# EAGLE design carrier v1.1 (EAGLE 9.1.1)
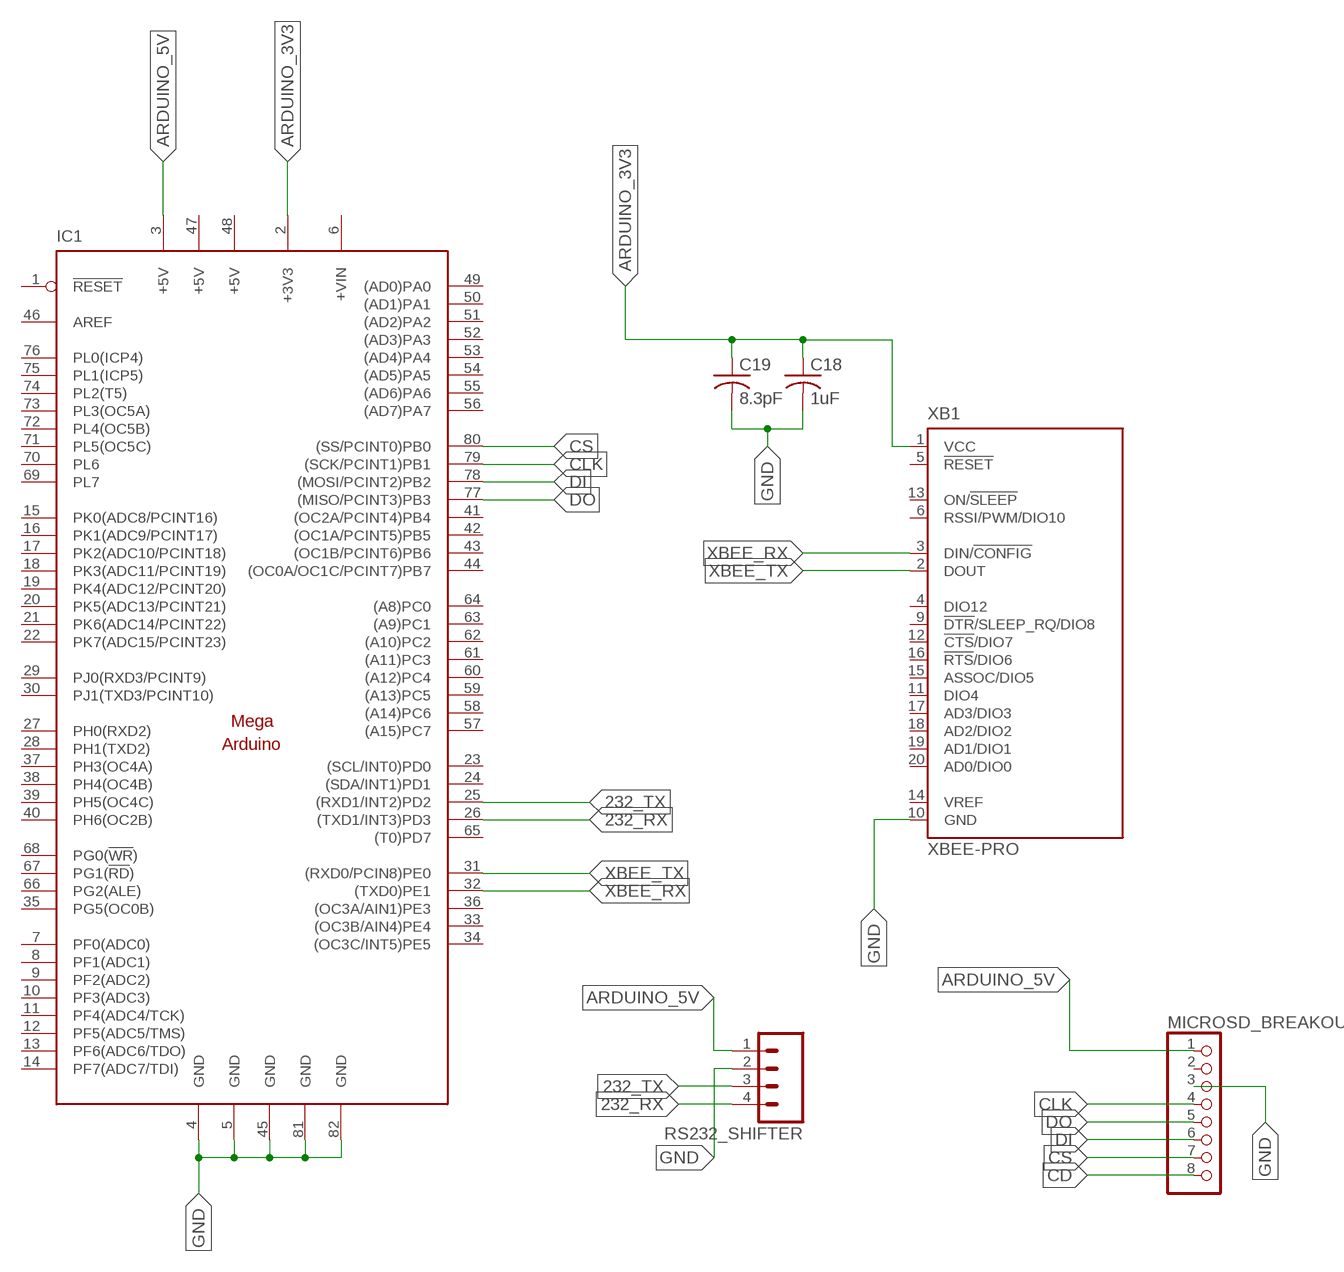
[diagram p0: schematic, sheet 1]

## Parts
C18  1uF  C-USC0805  [C0805]
C19  8.3pF  C-USC0805  [C0805]
IC1  MEGAARDUINO_1  [MEGA_ARDUINO]
MICROSD_BREAKOUT  PINHD-1X8BIG  [1X08-BIG]
RS232_SHIFTER  M04PTH  [1X04]
XB1  XBEE-PRO  [XBEE-PRO]

## Nets
232_RX: IC1.26((TXD1/INT3)PD3) RS232_SHIFTER.4
232_TX: IC1.25((RXD1/INT2)PD2) RS232_SHIFTER.3
ARDUINO_3V3: C18.1 C19.1 IC1.2(+3V3) XB1.1(VCC)
ARDUINO_5V: IC1.3(+5V) MICROSD_BREAKOUT.1 RS232_SHIFTER.1
CD: MICROSD_BREAKOUT.8
CLK: IC1.79((SCK/PCINT1)PB1) MICROSD_BREAKOUT.4
CS: IC1.80((SS/PCINT0)PB0) MICROSD_BREAKOUT.7
DI: IC1.78((MOSI/PCINT2)PB2) MICROSD_BREAKOUT.6
DO: IC1.77((MISO/PCINT3)PB3) MICROSD_BREAKOUT.5
GND: C18.2 C19.2 IC1.4(GND) IC1.5(GND) IC1.45(GND) IC1.81(GND) IC1.82(GND) MICROSD_BREAKOUT.3 RS232_SHIFTER.2 XB1.10(GND)
XBEE_RX: IC1.32((TXD0)PE1) XB1.3(DIN/!CONFIG)
XBEE_TX: IC1.31((RXD0/PCIN8)PE0) XB1.2(DOUT)
Unconnected: IC1.1(!RESET) IC1.7(PF0(ADC0)) IC1.8(PF1(ADC1)) IC1.9(PF2(ADC2)) IC1.10(PF3(ADC3)) IC1.11(PF4(ADC4/TCK)) IC1.12(PF5(ADC5/TMS)) IC1.13(PF6(ADC6/TDO)) IC1.14(PF7(ADC7/TDI)) IC1.15(PK0(ADC8/PCINT16)) IC1.16(PK1(ADC9/PCINT17)) IC1.17(PK2(ADC10/PCINT18)) IC1.18(PK3(ADC11/PCINT19)) IC1.19(PK4(ADC12/PCINT20)) IC1.20(PK5(ADC13/PCINT21)) IC1.21(PK6(ADC14/PCINT22)) IC1.22(PK7(ADC15/PCINT23)) IC1.23((SCL/INT0)PD0) IC1.24((SDA/INT1)PD1) IC1.27(PH0(RXD2)) IC1.28(PH1(TXD2)) IC1.29(PJ0(RXD3/PCINT9)) IC1.30(PJ1(TXD3/PCINT10)) IC1.33((OC3B/AIN4)PE4) IC1.34((OC3C/INT5)PE5) IC1.35(PG5(OC0B)) IC1.36((OC3A/AIN1)PE3) IC1.37(PH3(OC4A)) IC1.38(PH4(OC4B)) IC1.39(PH5(OC4C)) IC1.40(PH6(OC2B)) IC1.41((OC2A/PCINT4)PB4) IC1.42((OC1A/PCINT5)PB5) IC1.43((OC1B/PCINT6)PB6) IC1.44((OC0A/OC1C/PCINT7)PB7) IC1.46(AREF) IC1.49((AD0)PA0) IC1.50((AD1)PA1) IC1.51((AD2)PA2) IC1.52((AD3)PA3) IC1.53((AD4)PA4) IC1.54((AD5)PA5) IC1.55((AD6)PA6) IC1.56((AD7)PA7) IC1.57((A15)PC7) IC1.58((A14)PC6) IC1.59((A13)PC5) IC1.60((A12)PC4) IC1.61((A11)PC3) IC1.62((A10)PC2) IC1.63((A9)PC1) IC1.64((A8)PC0) IC1.65((T0)PD7) IC1.66(PG2(ALE)) IC1.67(PG1(!RD!)) IC1.68(PG0(!WR!)) IC1.69(PL7) IC1.70(PL6) IC1.71(PL5(OC5C)) IC1.72(PL4(OC5B)) IC1.73(PL3(OC5A)) IC1.74(PL2(T5)) IC1.75(PL1(ICP5)) IC1.76(PL0(ICP4)) MICROSD_BREAKOUT.2 XB1.4(DIO12) XB1.5(!RESET) XB1.6(RSSI/PWM/DIO10) XB1.9(!DTR!/SLEEP_RQ/DIO8) XB1.11(DIO4) XB1.12(!CTS!/DIO7) XB1.13(ON/!SLEEP) XB1.14(VREF) XB1.15(ASSOC/DIO5) XB1.16(!RTS!/DIO6) XB1.17(AD3/DIO3) XB1.18(AD2/DIO2) XB1.19(AD1/DIO1) XB1.20(AD0/DIO0)

## Power pins joined to a net without a drawn wire
+5V: IC1.47(+5V) IC1.48(+5V)
+VIN: IC1.6(+VIN)

## Library data of the parts
C18 C19 = resistor:C-US: CAPACITOR, American symbol
IC1 = arduino:MEGAARDUINO_1: The Arduino Mega is a microcontroller board based on the ATmega1280. - 54 digital input/output pins (of which 14 can be used as PWM outputs) - 16 analog inputs - 4 UARTs (hardware serial ports) - 16 MHz crystal oscillator - USB connection - power jack - ICSP header - reset button It contains everything needed to support the microcontroller; simply connect it to a computer with a USB cable or power it with a AC-to-DC adapter or battery to get started. The Mega is compatible with most shields designed for the Arduino Duemilanove or Diecimila. http://arduino.cc/en/Main/ArduinoBoardMega
MICROSD_BREAKOUT = adafruit:PINHD-1X8: PIN HEADER
RS232_SHIFTER = SparkFun-Connectors:M04: Header 4 Standard 4-pin 0.1" header. Use with straight break away headers (SKU : PRT-00116), right angle break away headers (PRT-00553), swiss pins (PRT-00743), machine pins (PRT-00117), and female headers (PRT-00115). Molex polarized connector foot print use with SKU : PRT-08231 with associated crimp pins and housings. 1MM SMD Version SKU: PRT-10208
XB1 = xbee:XBEE: XBee (TM) /XBee-PRO(TM) OEM RF Modules Source: MaxStream, Inc. xbee_productmanual.pdf; MPN: XBP24-AWI-001; OC_FARNELL: 1337916; OC_NEWARK: 42M2667

## Board
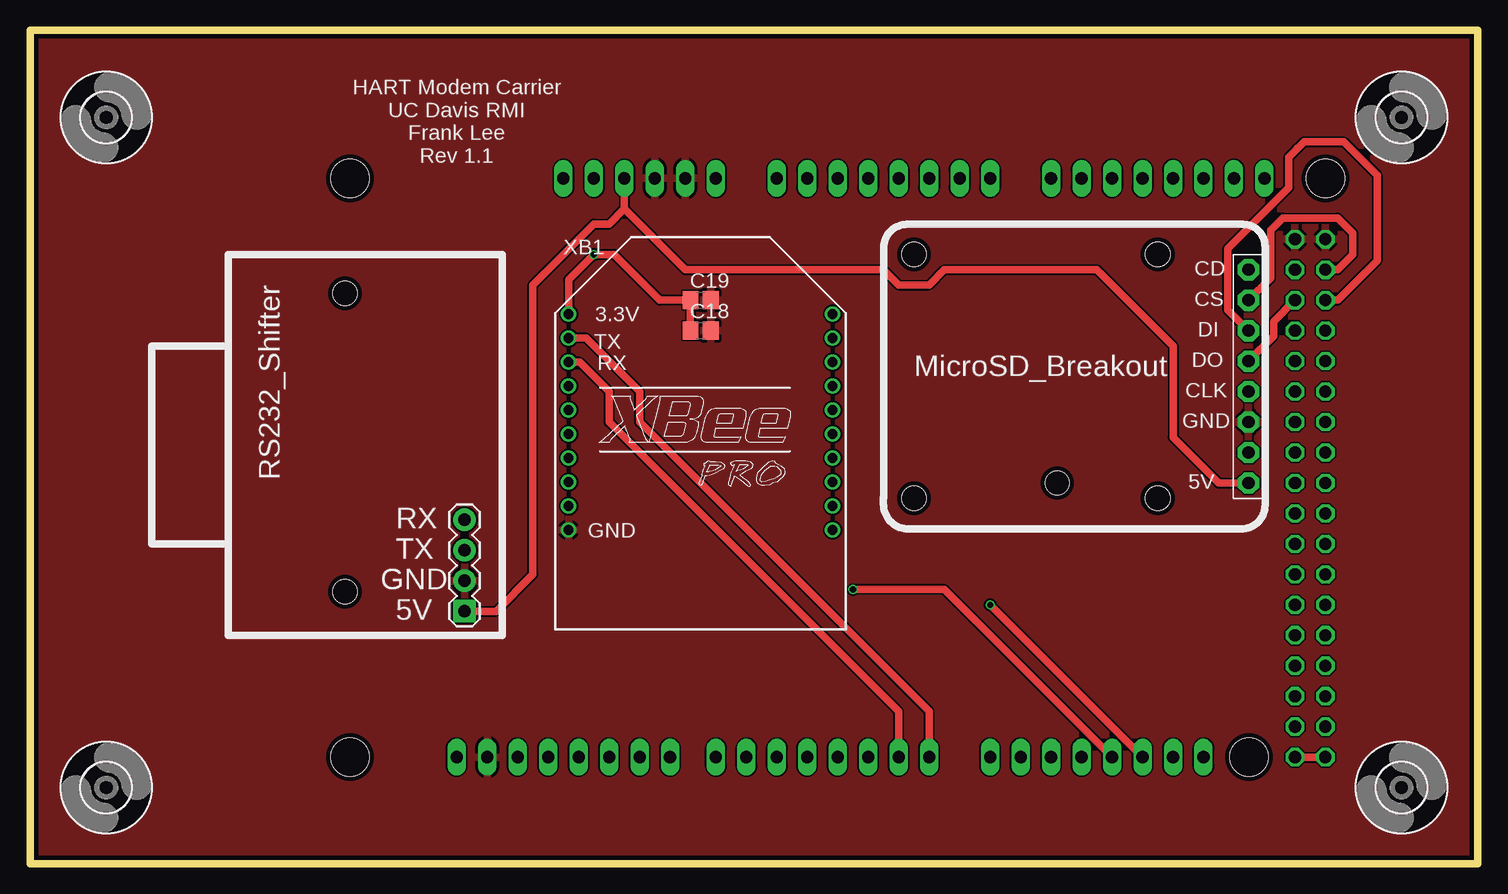
[diagram p1: board, top side]
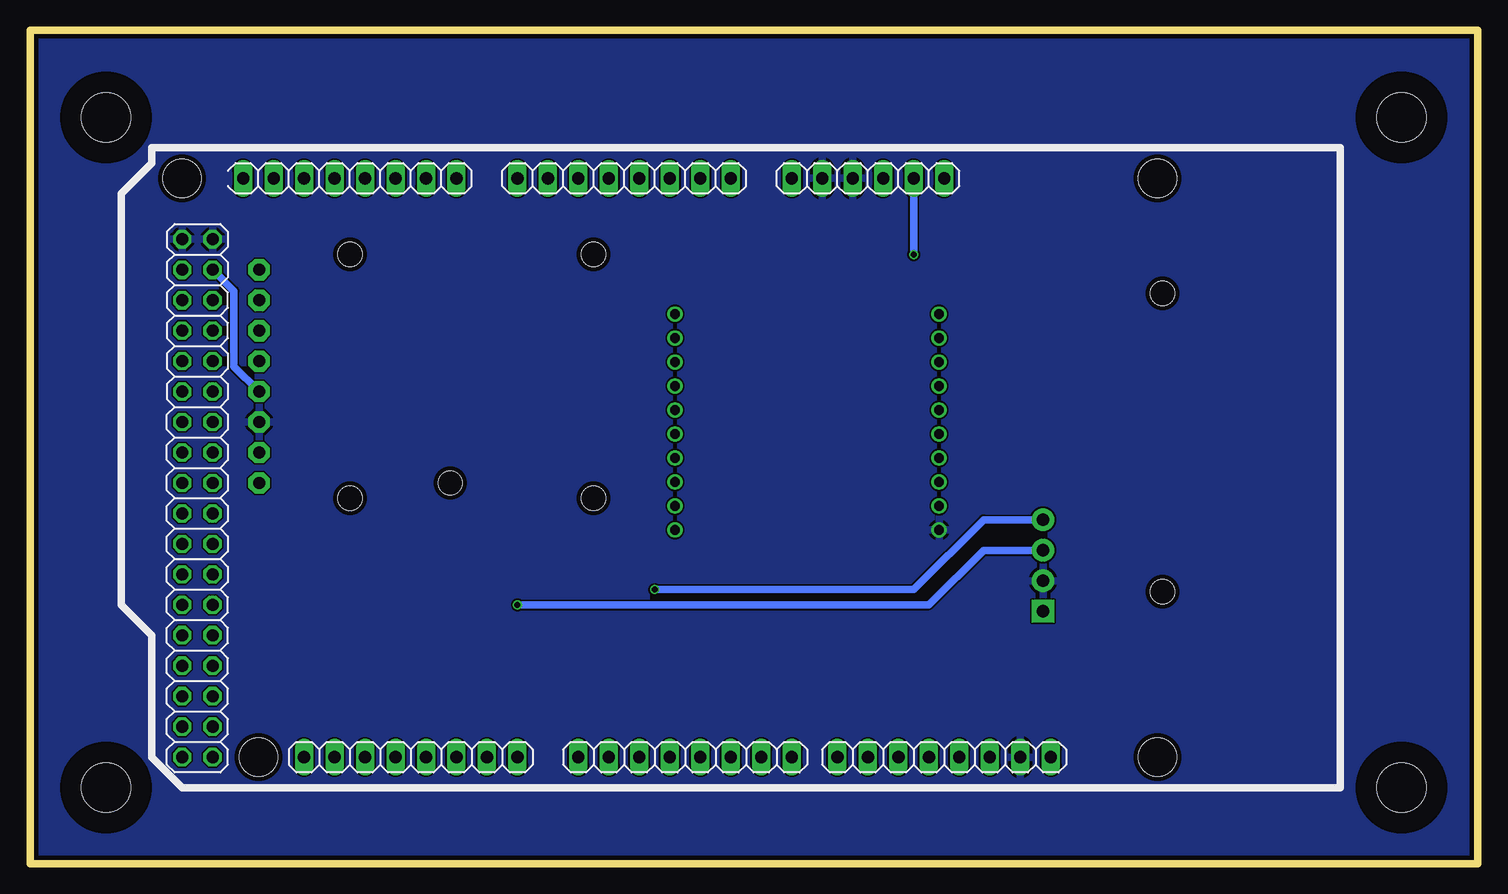
[diagram p2: board, bottom side, seen from below]

Size 120.63 x 69.52 mm. Coordinates in mm from the lower left corner, seen from the top.
Outline: 0,0 120.63,0 120.63,69.52 0,69.52 0,0
Copper layers (1*16): Top 0.035559375mm / dielectric 1.6mm / Bottom 0.035559375mm
Design rules "oshpark-2layer *": minimum track width 6mil, minimum drill 10mil, track to track 6mil, track to pad 6mil, pad to pad 6mil, via to via 6mil, smd to smd 6mil, copper to edge 15mil, drill to drill 6mil, minimum pad ring 5mil, minimum via ring 5mil, stop-mask expansion 2.5mil, vias tented up to drill 0mil, thermal gap 10mil
Holes 2.03 mm at 26.24,22.68 26.24,47.57 73.66,50.8 73.66,30.48 93.98,50.8 93.98,30.48

### Footprints (pad centres in the part's own frame; a part is rotated, then mirrored left to right if it is on the bottom)
C0805 = smd 1.3 x 1.5: 1 -0.85,0; 2 0.85,0
4,1 = hole 4.1: 0,0
MEGA_ARDUINO = drill 1.016 long: 1 33.02,2.54; 2 35.56,2.54; 3 38.1,2.54; 4 40.64,2.54; 5 43.18,2.54; 6 45.72,2.54; 7 50.8,2.54; 8 53.34,2.54; 9 55.88,2.54; 10 58.42,2.54; 11 60.96,2.54; 12 63.5,2.54; 13 66.04,2.54; 14 68.58,2.54; 15 73.66,2.54; 16 76.2,2.54; 17 78.74,2.54; 18 81.28,2.54; 19 83.82,2.54; 20 86.36,2.54; 21 88.9,2.54; 22 91.44,2.54; 23 86.36,50.8; 24 83.82,50.8; 25 81.28,50.8; 26 78.74,50.8; 27 76.2,50.8; 28 73.66,50.8; 29 71.12,50.8; 30 68.58,50.8; 31 63.5,50.8; 32 60.96,50.8; 33 58.42,50.8; 34 55.88,50.8; 35 53.34,50.8; 36 50.8,50.8; 37 48.26,50.8; 38 45.72,50.8; 39 41.91,50.8; 40 39.37,50.8; 41 36.83,50.8; 42 34.29,50.8; 43 31.75,50.8; 44 29.21,50.8; 45 26.67,50.8; 46 24.13,50.8 | drill 1.016 octagon: 47 93.98,50.8; 48 96.52,50.8; 49 93.98,48.26; 50 96.52,48.26; 51 93.98,45.72; 52 96.52,45.72; 53 93.98,43.18; 54 96.52,43.18; 55 93.98,40.64; 56 96.52,40.64; 57 93.98,38.1; 58 96.52,38.1; 59 93.98,35.56; 60 96.52,35.56; 61 93.98,33.02; 62 96.52,33.02; 63 93.98,30.48; 64 96.52,30.48; 65 93.98,27.94; 66 96.52,27.94; 67 93.98,25.4; 68 96.52,25.4; 69 93.98,22.86; 70 96.52,22.86; 71 93.98,20.32; 72 96.52,20.32; 73 93.98,17.78; 74 96.52,17.78; 75 93.98,15.24; 76 96.52,15.24; 77 93.98,12.7; 78 96.52,12.7; 79 93.98,10.16; 80 96.52,10.16; 81 93.98,7.62; 82 96.52,7.62 | hole 3.2: 15.24,50.8; 15.24,2.54; 90.17,50.8; 96.52,2.54 | hole 2: 74.168,27.94
1X08-BIG = drill 1.016 pad 1.778 octagon: 1 -8.89,0; 2 -6.35,0; 3 -3.81,0; 4 -1.27,0; 5 1.27,0; 6 3.81,0; 7 6.35,0; 8 8.89,0
1X04 = drill 1.016 pad 1.88 square: 1 0,0 | drill 1.016 pad 1.88: 2 2.54,0; 3 5.08,0; 4 7.62,0
XBEE-PRO = drill 0.8 pad 1.27: 1 -11,9; 2 -11,7; 3 -11,5; 4 -11,3; 5 -11,1; 6 -11,-1; 7 -11,-3; 8 -11,-5; 9 -11,-7; 10 -11,-9; 11 11,-9; 12 11,-7; 13 11,-5; 14 11,-3; 15 11,-1; 16 11,1; 17 11,3; 18 11,5; 19 11,7; 20 11,9

### Placement (x,y rotation side)
C18  55.88,44.45 0 top
C19  55.88,46.99 0 top
H1  MOUNT-HOLE4.1  [4,1]  114.3,62.23 0 top
H2  MOUNT-HOLE4.1  [4,1]  6.35,62.23 0 top
H3  MOUNT-HOLE4.1  [4,1]  6.35,6.35 0 top
H10  MOUNT-HOLE4.1  [4,1]  114.3,6.35 0 top
IC1  11.43,59.69 180 bottom
MICROSD_BREAKOUT  101.54,40.64 90 top
RS232_SHIFTER  36.21,21.06 90 top
XB1  55.88,36.83 0 top

### Tracks (layer width: path | path; a pad name or v marks a point on that pad's centre or on a via)
232_RX  (via drill 0.51)
  Top 0.61: IC1.26 76.2,22.86 v68.58,22.86
  Bottom 0.61: v68.58,22.86 46.99,22.86 41.17,28.68 RS232_SHIFTER.4
232_TX  (via drill 0.51)
  Top 0.61: IC1.25 v80.01,21.59
  Bottom 0.61: v80.01,21.59 45.72,21.59 41.17,26.14 RS232_SHIFTER.3
+5V
  Top 0.61: IC1.47 IC1.48
ARDUINO_3V3  (via drill 0.51)
  Top 0.61: C18.1 C19.1 52.49,46.99 48.68,50.8 v46.99,50.8 44.88,48.69 XB1.1
  Bottom 0.61: v46.99,50.8 IC1.2
ARDUINO_5V
  Top 0.61: RS232_SHIFTER.1 38.84,21.06 41.91,24.13 41.91,48.26 46.99,53.34 48.26,53.34 49.53,54.61 | IC1.3 49.53,54.61 | MICROSD_BREAKOUT.1 99.06,31.75 95.25,35.56 95.25,43.18 88.9,49.53 76.2,49.53 74.93,48.26 72.39,48.26 71.12,49.53 54.61,49.53 49.53,54.61
CLK
  Bottom 0.61: MICROSD_BREAKOUT.4 103.63,41.47 103.63,47.75 IC1.79
CS
  Top 0.61: MICROSD_BREAKOUT.7 103.38,48.83 103.38,52.83 104.39,53.85 108.97,53.85 110.24,52.58 110.24,50.8 108.97,49.53 IC1.80
DI
  Top 0.61: MICROSD_BREAKOUT.6 99.82,46.16 99.82,51.31 104.9,56.39 104.9,58.93 105.41,59.44 | 105.41,59.44 106.17,60.2 106.68,60.2 109.47,60.2 112.27,57.4 112.27,50.29 108.97,46.99 IC1.78 | 105.41,59.44 105.66,59.69
DO
  Top 0.61: MICROSD_BREAKOUT.5 103.63,44.01 103.63,45.21 IC1.77
GND
  pour Top: -13.97,81.28 128.27,81.28 128.27,-6.35 -13.97,-6.35
  pour Bottom: -7.62,76.2 123.19,76.2 123.19,-3.81 -7.62,-3.81
XBEE_RX
  Top 0.61: IC1.32 72.39,12.7 48.26,36.83 48.26,39.37 45.8,41.83 XB1.3
XBEE_TX
  Top 0.61: IC1.31 74.93,12.7 50.8,36.83 50.8,39.37 46.34,43.83 XB1.2

### Text on the board
tPlace: HART Modem Carrier / UC Davis RMI / Frank Lee / Rev 1.1 | CD | RS232_Shifter | 3.3V | CS | TX | DI | RX | MicroSD_Breakout | DO | CLK | GND | 5V | RX | GND | TX | GND | 5V